# EAGLE design Flight_Controller_Iter2 (EAGLE 9.4.2)

## Sheet 1 of 3
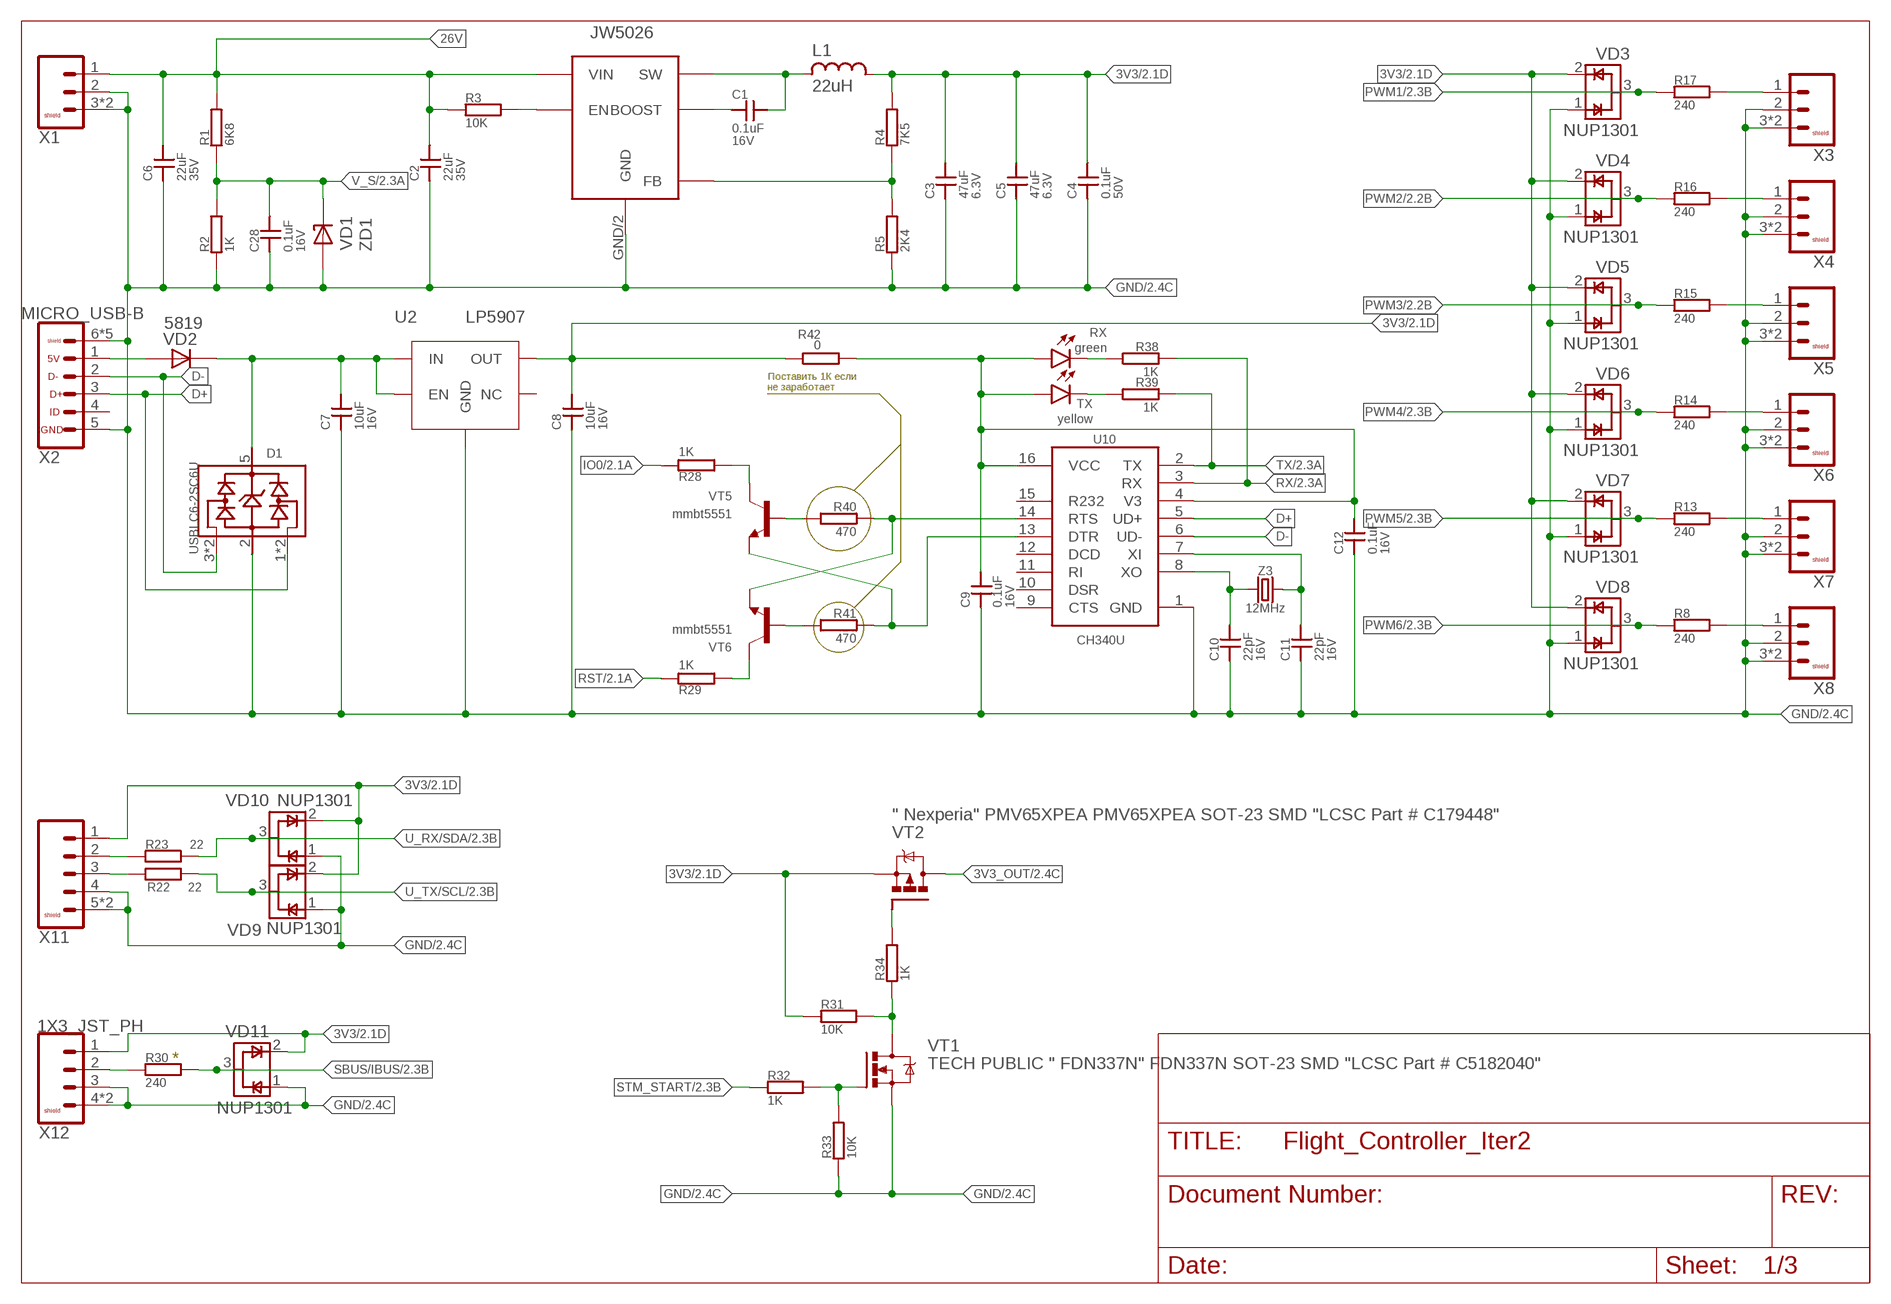
[diagram p0: schematic, sheet 1]

### Parts
C1  0.1uF  C0402  [0402]
C2  22uF  C0805  [0805]
C3  47uF  C0603_SMALL  [0603_SMALL]
C4  0.1uF  C0603_SMALL  [0603_SMALL]
C5  47uF  C0603_SMALL  [0603_SMALL]
C6  22uF  C0805  [0805]
C7  10uF  C0402  [0402]
C8  10uF  C0402  [0402]
C9  0.1uF  C0402  [0402]
C10  22pF  C0402  [0402]
C11  22pF  C0402  [0402]
C12  0.1uF  C0402  [0402]
C28  0.1uF  C0402  [0402]
D1  USBLC6-2SC6U  [SOT23-6]
L1  22uH  INDUCTOR0420CDMC  [0420CDMC]
R1  6K8  R0402  [0402]
R2  1K  R0402  [0402]
R3  10K  R0402  [0402]
R4  7K5  R0402  [0402]
R5  2K4  R0402  [0402]
R8  240  R0402  [0402]
R13  240  R0402  [0402]
R14  240  R0402  [0402]
R15  240  R0402  [0402]
R16  240  R0402  [0402]
R17  240  R0402  [0402]
R22  22  R0402  [0402]
R23  22  R0402  [0402]
R28  1K  R0402  [0402]
R29  1K  R0402  [0402]
R30  240  R0402  [0402]
R31  10K  R0402  [0402]
R32  1K  R0402  [0402]
R33  10K  R0402  [0402]
R34  1K  R0402  [0402]
R38  1K  R0402  [0402]
R39  1K  R0402  [0402]
R40  470  R0402  [0402]
R41  470  R0402  [0402]
R42  0  R0402  [0402]
RX  green  LED1608  [0603]
TX  yellow  LED1608  [0603]
U1  JW5026  TPS560430  [SOT-23-6]
U2  LP5907  [SOT-23-5]
U10  CH340U  [SOIC-16]
VD1  ZD1  ZENER-DIODES  [SOD-323]
VD2  5819  DIODE323  [SOD-323]
VD3  NUP1301  ESD_PROTECTIONSOT123  [SOT23]
VD4  NUP1301  ESD_PROTECTIONSOT123  [SOT23]
VD5  NUP1301  ESD_PROTECTIONSOT123  [SOT23]
VD6  NUP1301  ESD_PROTECTIONSOT123  [SOT23]
VD7  NUP1301  ESD_PROTECTIONSOT123  [SOT23]
VD8  NUP1301  ESD_PROTECTIONSOT123  [SOT23]
VD9  NUP1301  ESD_PROTECTIONSOT123  [SOT23]
VD10  NUP1301  ESD_PROTECTIONSOT123  [SOT23]
VD11  NUP1301  ESD_PROTECTIONSOT123  [SOT23]
VT1  TECH PUBLIC " FDN337N" FDN337N SOT-23 SMD "LCSC Part # C5182040"  N-CANNELSOT-23  [SOT-23]
VT2  " Nexperia" PMV65XPEA PMV65XPEA SOT-23 SMD "LCSC Part # C179448"  P-CANNELSOT-23  [SOT-23]
VT5  mmbt5551  NPNSOT-23  [SOT-23]
VT6  mmbt5551  NPNSOT-23  [SOT-23]
X1  1X2_JST_PH_LF2  [JST-PH-SM2-(LF)]
X2  MICRO_USB-B  [1981584-1]
X3  1X2_JST_PH_LF2  [JST-PH-SM2-(LF)]
X4  1X2_JST_PH_LF2  [JST-PH-SM2-(LF)]
X5  1X2_JST_PH_LF2  [JST-PH-SM2-(LF)]
X6  1X2_JST_PH_LF2  [JST-PH-SM2-(LF)]
X7  1X2_JST_PH_LF2  [JST-PH-SM2-(LF)]
X8  1X2_JST_PH_LF2  [JST-PH-SM2-(LF)]
X11  1X4_JST_PH_2JST_PH_SM4_2MM(LF)  [JST-PH-SM4-(LF)]
X12  1X3_JST_PH  [JST-PH-SM3-(LF)]
Z3  12MHz  CRYSTAL4FOOT  [CRYSTAL-SMD-3.2X2.5MM]

### Nets
3V3: C3.P$2 C4.P$2 C5.P$2 C8.2 L1.2 R4.2 R31.1 R42.2 U2.5(OUT) VD3.2(VCC) VD4.2(VCC) VD5.2(VCC) VD6.2(VCC) VD7.2(VCC) VD8.2(VCC) VD9.2(VCC) VD10.2(VCC) VD11.2(VCC) VT2.2(S) X11.1 X12.1 ; also sheet 2
3V3_OUT: VT2.3(D) ; also sheet 2
26V: C2.P$2 C6.P$2 R1.2 R3.1 U1.IN/5(VIN) X1.1
D+: D1.1(I/O1) D1.6(I/O1) U10.5(UD+) X2.3(D+)
D-: D1.3(I/O2) D1.4(I/O2) U10.6(UD-) X2.2(D-)
DTR: R41.1 U10.13(DTR) VT5.2(E)
GND: C2.P$1 C3.P$1 C4.P$1 C5.P$1 C6.P$1 C7.1 C8.1 C9.1 C10.1 C11.1 C12.1 C28.1 D1.2(GND) R2.1 R5.1 R33.1 U1.GND/2(GND) U2.2(GND) U10.1(GND) VD1.1(A) VD3.1(GND) VD4.1(GND) VD5.1(GND) VD6.1(GND) VD7.1(GND) VD8.1(GND) VD9.1(GND) VD10.1(GND) VD11.1(GND) VT1.2(S) X1.2 X1.3 X1.4 X2.5(GND) X2.6(SHIELD) X2.P$1(SHIELD) X2.P$2(SHIELD) X2.P$3(SHIELD) X2.P$7(SHIELD) X3.2 X3.3 X3.4 X4.2 X4.3 X4.4 X5.2 X5.3 X5.4 X6.2 X6.3 X6.4 X7.2 X7.3 X7.4 X8.2 X8.3 X8.4 X11.4 X11.5 X11.6 X12.3 X12.4 X12.5 ; also sheet 2
IO0: R28.1 ; also sheet 2
N$1: VD2.1(A) X2.1(5V)
N$2: C7.2 D1.5(VBUS) U2.1(IN) U2.3(EN) VD2.2(C)
N$4: R3.2 U1.EN/4(EN)
N$5: C1.1 U1.BOOST/1(BOOST)
N$6: C1.2 L1.1 U1.SW/6(SW)
N$8: R4.1 R5.2 U1.FB/3(FB)
N$11: R17.2 X3.1
N$13: R16.2 X4.1
N$14: R15.2 X5.1
N$15: R14.2 X6.1
N$17: R13.2 X7.1
N$19: R8.2 X8.1
N$21: R38.2 RX.P$1(C)
N$22: R39.2 TX.P$1(C)
N$23: R28.2 VT5.3(C)
N$24: C10.2 U10.8(XO) Z3.3
N$25: C11.2 U10.7(XI) Z3.1
N$26: R40.2 VT5.1(B)
N$27: R41.2 VT6.1(B)
N$32: R29.2 VT6.3(C)
N$35: R23.1 X11.2
N$36: R22.1 X11.3
N$38: R30.1 X12.2
N$45: R31.2 R34.1 VT1.3(D)
N$46: R32.2 R33.2 VT1.1(G)
N$47: R34.2 VT2.1(G)
PWM1: R17.1 VD3.3(I/O) ; also sheet 2
PWM2: R16.1 VD4.3(I/O) ; also sheet 2
PWM3: R15.1 VD5.3(I/O) ; also sheet 2
PWM4: R14.1 VD6.3(I/O) ; also sheet 2
PWM5: R13.1 VD7.3(I/O) ; also sheet 2
PWM6: R8.1 VD8.3(I/O) ; also sheet 2
RST: R29.1 ; also sheet 2
RTS: R40.1 U10.14(RTS) VT6.2(E)
RX: R38.1 U10.3(RX) ; also sheet 2
SBUS/IBUS: R30.2 VD11.3(I/O) ; also sheet 2
STM_START: R32.1 ; also sheet 2
TX: R39.1 U10.2(TX) ; also sheet 2
U_RX/SDA: R23.2 VD10.3(I/O) ; also sheet 2
U_TX/SCL: R22.2 VD9.3(I/O) ; also sheet 2
V_S: C28.2 R1.1 R2.2 VD1.2(C) ; also sheet 2
VCC_1: C9.2 C12.2 R42.1 RX.P$2(A) TX.P$2(A) U10.4(V3) U10.16(VCC)
Unconnected: U2.4(NC) U10.9(CTS) U10.10(DSR) U10.11(RI) U10.12(DCD) U10.15(R232) X2.4(ID)

### Notes on the sheet
- Поставить 1К если
  не заработает
- *

## Sheet 2 of 3
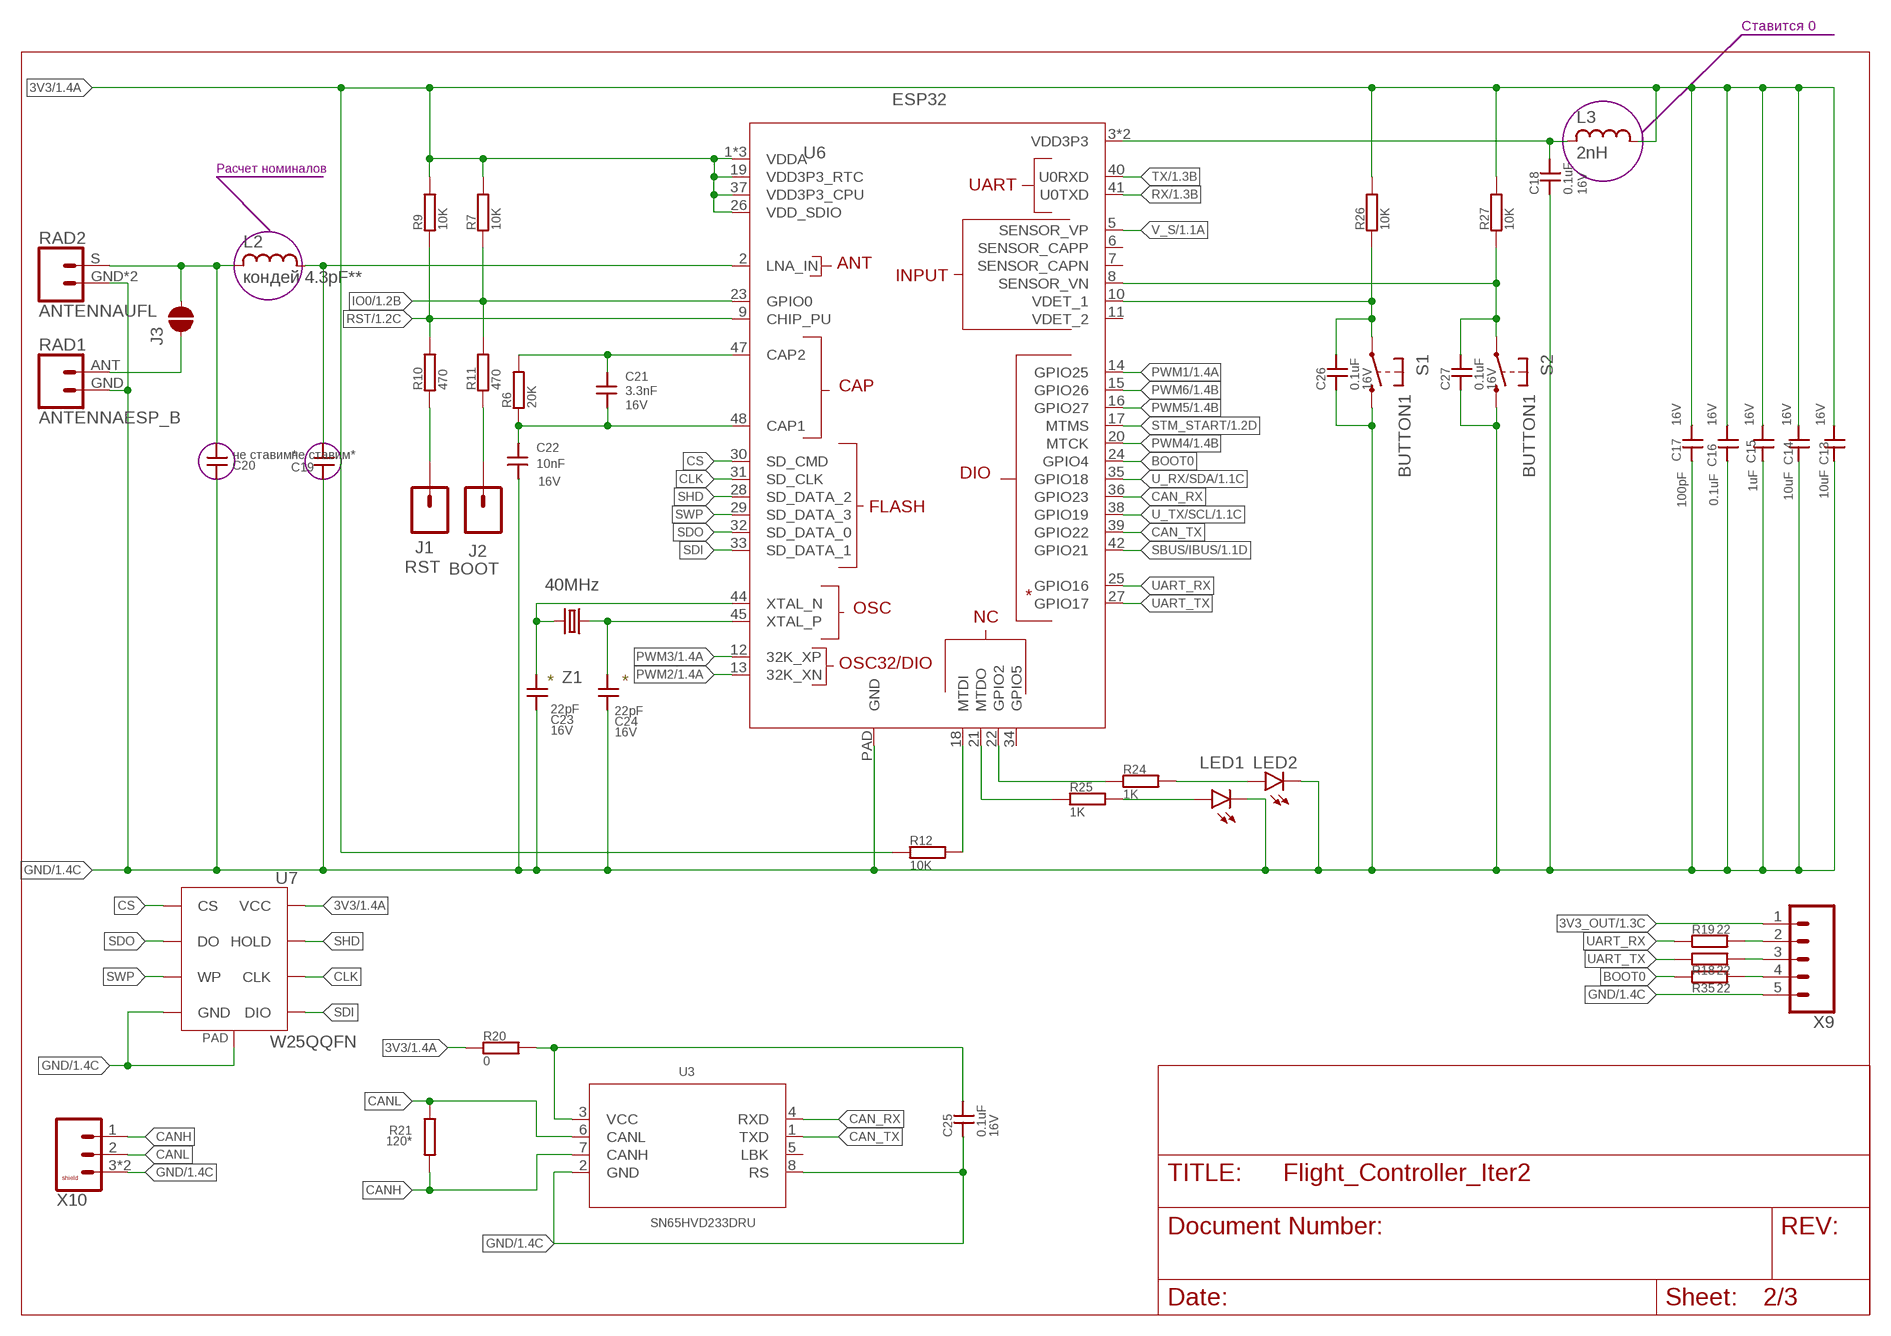
[diagram p1: schematic, sheet 2]

### Parts
C13  10uF  C0402  [0402]
C14  10uF  C0402  [0402]
C15  1uF  C0402  [0402]
C16  0.1uF  C0402  [0402]
C17  100pF  C0402  [0402]
C18  0.1uF  C0402  [0402]
C19  не ставим*  C0402  [0402]
C20  не ставим*  C0402  [0402]
C21  3.3nF  C0402  [0402]
C22  10nF  C0402  [0402]
C23  22pF  C0402  [0402]
C24  22pF  C0402  [0402]
C25  0.1uF  C0402  [0402]
C26  0.1uF  C0402  [0402]
C27  0.1uF  C0402  [0402]
J1  RST  1X1_PAD1X1PAD  [1X1_PAD_T]
J2  BOOT  1X1_PAD1X1PAD  [1X1_PAD_T]
J3  TEST_PAD1X1MM  [TEST_PAD]
L2  кондей 4.3pF**  L0402  [0402]
L3  2nH  L0402  [0402]
LED1  LED0402  [0402]
LED2  LED0402  [0402]
R6  20K  R0402  [0402]
R7  10K  R0402  [0402]
R9  10K  R0402  [0402]
R10  470  R0402  [0402]
R11  470  R0402  [0402]
R12  10K  R0402  [0402]
R18  22  R0402  [0402]
R19  22  R0402  [0402]
R20  0  R0402  [0402]
R21  120*  R0603_SMALL  [0603_SMALL]
R24  1K  R0402  [0402]
R25  1K  R0402  [0402]
R26  10K  R0402  [0402]
R27  10K  R0402  [0402]
R35  22  R0402  [0402]
RAD1  ANTENNAESP_B  [2.4GHZB]
RAD2  ANTENNAUFL  [U.FL]
S1  BUTTON1  [3X4X2]
S2  BUTTON1  [3X4X2]
U3  SN65HVD233DRU  [SOIC-8]
U6  ESP32  [QFN48(5X5MM)]
U7  W25QQFN  [WSON8X6-MM]
X9  1X5FFC5-1MM  [FFC-1MM_5]
X10  1X2_JST_PH_LF2  [JST-PH-SM2-(LF)]
Z1  40MHz  CRYSTAL4FOOT  [CRYSTAL-SMD-3.2X2.5MM]

### Nets
3V3: C13.2 C14.2 C15.2 C16.2 C17.2 L3.2 R7.2 R9.2 R12.1 R20.1 R26.2 R27.2 U6.1(VDDA) U6.19(VDD3P3_RTC) U6.26(VDD_SDIO) U6.37(VDD3P3_CPU) U6.43(VDDA) U6.46(VDDA) U7.P$9(VCC) ; also sheet 1
3V3_OUT: X9.1 ; also sheet 1
BOOT0: R35.1 U6.24(GPIO4)
CAN_RX: U3.4(RXD) U6.36(GPIO23)
CAN_TX: U3.1(TXD) U6.39(GPIO22)
CANH: R21.P$1 U3.7(CANH) X10.1
CANL: R21.P$2 U3.6(CANL) X10.2
CLK: U6.31(SD_CLK) U7.P$7(CLK)
CS: U6.30(SD_CMD) U7.P$2(CS)
GND: C13.1 C14.1 C15.1 C16.1 C17.1 C18.1 C19.1 C20.1 C22.1 C23.1 C24.1 C25.1 C26.1 C27.1 LED1.1(C) LED2.1(C) RAD1.GND RAD2.GND RAD2.GND1(GND) S1.P$2 S2.P$2 U3.2(GND) U3.8(RS) U6.PAD(GND) U7.P$1 U7.P$5(GND) X9.5 X10.3 X10.4 ; also sheet 1
IO0: R7.1 R11.2 U6.23(GPIO0) ; also sheet 1
LED1: R24.1 U6.22(GPIO2)
LED2: R25.1 U6.21(MTDO)
N$3: R18.2 X9.3
N$7: C19.2 L2.2 U6.2(LNA_IN)
N$9: C20.2 J3.P$2 L2.1 RAD2.S(ANTENNA)
N$10: C21.2 R6.2 U6.47(CAP2)
N$12: C21.1 C22.2 R6.1 U6.48(CAP1)
N$16: C23.2 U6.44(XTAL_N) Z1.3
N$18: C24.2 U6.45(XTAL_P) Z1.1
N$20: R12.2 U6.18(MTDI)
N$28: C18.2 L3.1 U6.3(VDD3P3) U6.4(VDD3P3)
N$29: R19.2 X9.2
N$30: LED2.2(A) R24.2
N$31: LED1.2(A) R25.2
N$33: J1.P$1 R10.1
N$34: J2.P$1 R11.1
N$42: J3.P$1 RAD1.ANT(ANTENNA)
N$48: R35.2 X9.4
PWM1: U6.14(GPIO25) ; also sheet 1
PWM2: U6.13(32K_XN) ; also sheet 1
PWM3: U6.12(32K_XP) ; also sheet 1
PWM4: U6.20(MTCK) ; also sheet 1
PWM5: U6.16(GPIO27) ; also sheet 1
PWM6: U6.15(GPIO26) ; also sheet 1
RST: R9.1 R10.2 U6.9(CHIP_PU) ; also sheet 1
RX: U6.41(U0TXD) ; also sheet 1
SBUS/IBUS: U6.42(GPIO21) ; also sheet 1
SDI: U6.33(SD_DATA_1) U7.P$6(DIO)
SDO: U6.32(SD_DATA_0) U7.P$3(DO)
SHD: U6.28(SD_DATA_2) U7.P$8(HOLD)
STM_START: U6.17(MTMS) ; also sheet 1
SW1: C27.2 R27.1 S2.P$1 U6.8(SENSOR_VN)
SW2: C26.2 R26.1 S1.P$1 U6.10(VDET_1)
SWP: U6.29(SD_DATA_3) U7.P$4(WP)
TX: U6.40(U0RXD) ; also sheet 1
U_RX/SDA: U6.35(GPIO18) ; also sheet 1
U_TX/SCL: U6.38(GPIO19) ; also sheet 1
UART_RX: R19.1 U6.25(GPIO16)
UART_TX: R18.1 U6.27(GPIO17)
V_S: U6.5(SENSOR_VP) ; also sheet 1
VCC: C25.2 R20.2 U3.3(VCC)
Unconnected: U3.5(LBK) U6.6(SENSOR_CAPP) U6.7(SENSOR_CAPN) U6.11(VDET_2) U6.34(GPIO5)

### Notes on the sheet
- Ставится 0
- Расчет номиналов
- * | *

## Sheet 3 of 3

## Library data of the parts
C1 C7-C18 C21-C28 = LARS_409_R,C,L:C; VOLTAGE: 16V
C2 C6 = LARS_409_R,C,L:C; VOLTAGE: 35V
C3 C5 = LARS_409_R,C,L:C; VOLTAGE: 6.3V
C4 = LARS_409_R,C,L:C; VOLTAGE: 50V
C19 C20 = LARS_409_R,C,L:C
D1 = LARS_409_MC:USBLC6-2SC6
J1 J2 = LARS_409_CONNECTORS:1X1_PAD
J3 = LARS_409_CONNECTORS:TEST_PAD
L1 = LARS_409_INDUCTOR:INDUCTOR
L2 L3 = LARS_409_R,C,L:L
LED1 LED2 RX TX = LARS_409_LED:LED
R1-R35 R38-R42 = LARS_409_R,C,L:R
RAD1 RAD2 = LARS_409_RADIO:ANTENNA
S1 S2 = LARS_409_SWITCH:BUTTON
U1 = LARS_409_DC-DC:TPS560430
U2 = LARS_409_DC-DC:LP5907
U3 = LARS_409_MC:SN65HVD233DR
U6 = LARS_409_MK:ESP32
U7 = LARS_409_MC:W25Q
U10 = LARS_409_MC:CH340
VD1 = LARS_409_DIODE:ZENER-DIODES
VD2 = LARS_409_DIODE:DIODE
VD3-VD11 = LARS_409_DIODE:ESD_PROTECTION
VT1 = LARS_409_TRANSISTORS:N-CANNEL
VT2 = LARS_409_TRANSISTORS:P-CANNEL
VT5 VT6 = LARS_409_TRANSISTORS:NPN
X1 X3-X8 X10 = LARS_409_CONNECTORS:1X2_JST_PH_LF2
X2 = LARS_409_USB:MICRO_USB-B
X9 = LARS_409_CONNECTORS:1X5
X11 = LARS_409_CONNECTORS:1X4_JST_PH_2
X12 = LARS_409_CONNECTORS:1X3_JST_PH
Z1 Z3 = LARS_409_CLOCKS:CRYSTAL

## Board
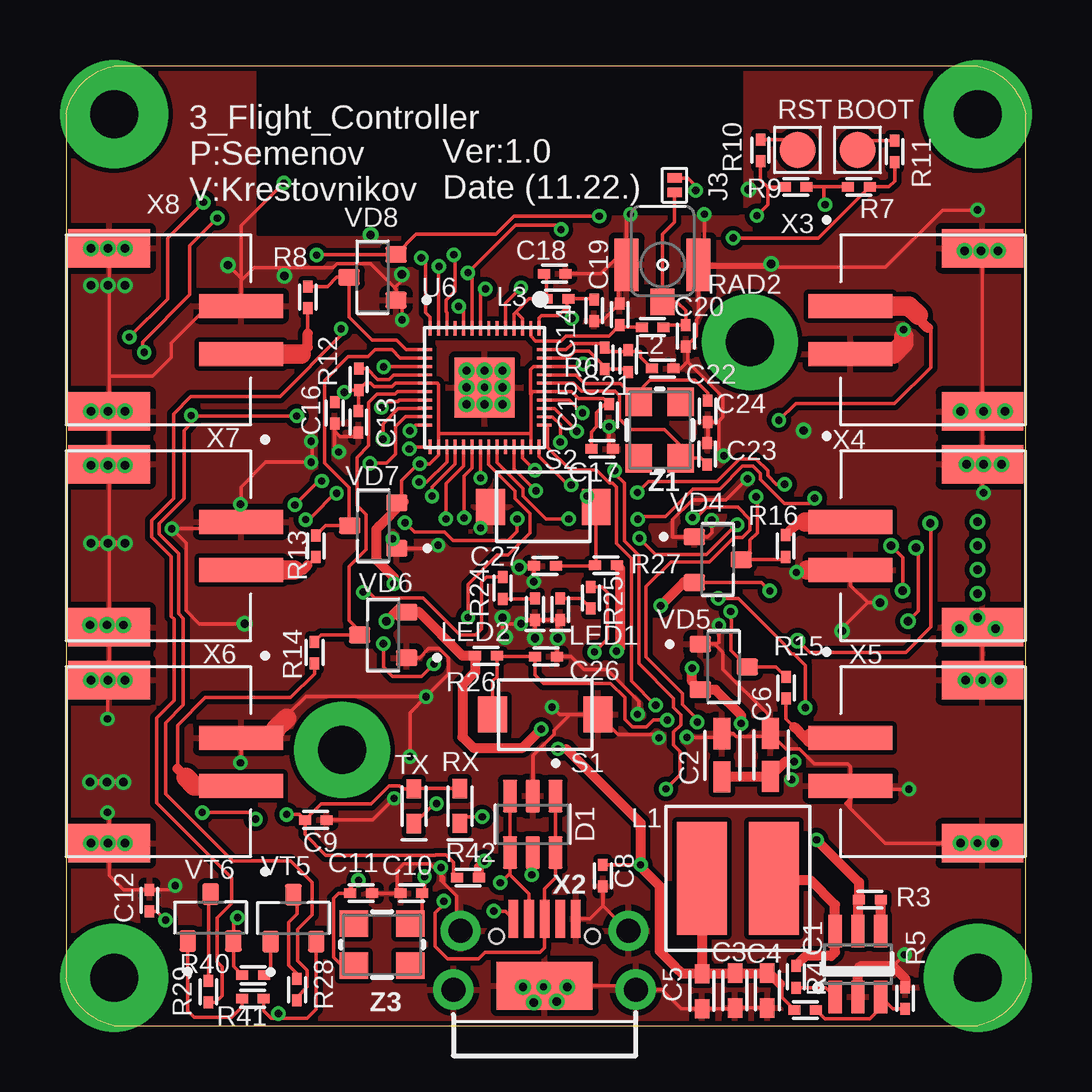
[diagram p2: board, top side]
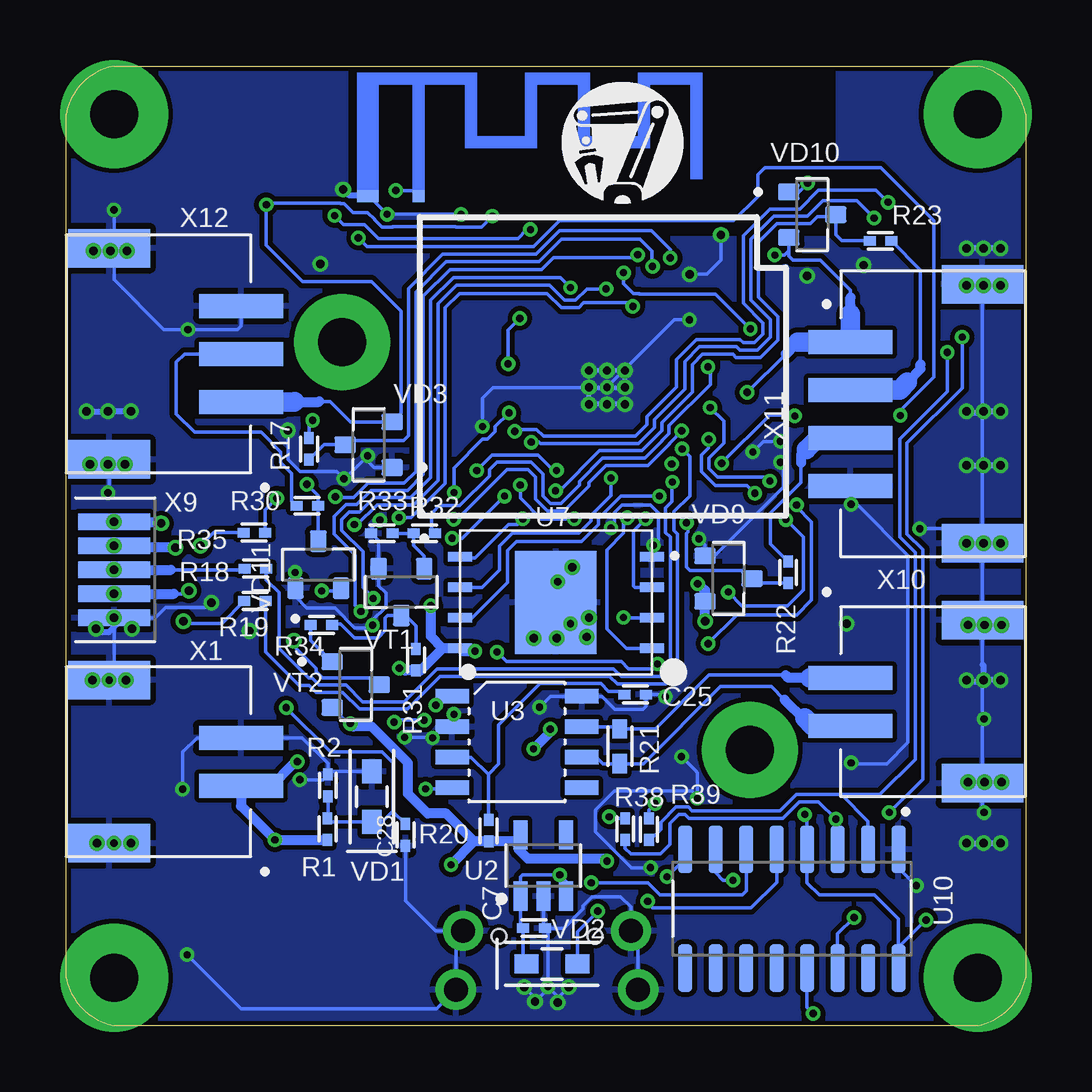
[diagram p3: board, bottom side, seen from below]

Size 40 x 40 mm. Coordinates in mm from the lower left corner, seen from the top.
Outline: 2,0 38,0 arc67 40,2 40,38 arc67 38,40 2,40 arc67 0,38 0,2 arc67 2,0
Copper layers (1*16): Top 0.035mm / dielectric 1.6mm / Bottom 0.035mm
Design rules "pcbWAY": minimum track width 6mil, minimum drill 0.3mm, track to track 6mil, track to pad 6mil, pad to pad 6mil, via to via 6mil, smd to smd 0mil, copper to edge 0.2mm, drill to drill 0.25mm, minimum pad ring 0.15mm, minimum via ring 0.15mm, stop-mask expansion 2mil, vias tented up to drill 3mm, thermal gap 10mil

### Footprints (pad centres in the part's own frame; a part is rotated, then mirrored left to right if it is on the bottom)
0402 = smd 0.5 x 0.4: 1 -0.45,0; 2 0.45,0
0805 = smd 1.3 x 0.7: P$1 -0.9,0; P$2 0.9,0
0603_SMALL = smd 0.8 x 0.6: P$1 -0.727,0; P$2 0.727,0
SOT23-6 = smd 1.36 x 0.6: 1 -1.175,0.95; 2 -1.175,0; 3 -1.175,-0.95; 4 1.175,-0.95; 5 1.175,0; 6 1.175,0.95
1X1_PAD_T = smd 1.5 x 1.5: P$1 0,0
TEST_PAD = smd 0.4 x 0.6: P$1 -0.3,0; P$2 0.3,0
0420CDMC = smd 2.1 x 4.7: 1 -1.5,0; 2 1.5,0
2.4GHZB = smd 0.5 x 0.5 bottom: ANT 4.957,-2.006 | smd 0.9 x 0.5 bottom: GND 7.057,-2.006
U.FL = smd 1 x 2.2: GND -1.5,0; GND1 1.5,0 | smd 1 x 1.1: S 0,-1.55
0603 = smd 0.8 x 0.6: P$1 -0.727,0; P$2 0.727,0
3X4X2 = smd 1.2 x 1.5: P$1 -2.2,0; P$2 2.2,0
SOT-23-6 = smd 0.55 x 1.35: BOOST/1 -0.95,-1.375; EN/4 0.95,1.375; FB/3 0.95,-1.375; GND/2 0,-1.375; IN/5 0,1.375; SW/6 -0.95,1.375
SOT-23-5 = smd 1.217 x 0.589: 1 -1.276,0.95; 2 -1.276,0; 3 -1.276,-0.95; 4 1.276,-0.95; 5 1.276,0.95
SOIC-8 = smd 1.4 x 0.6: 1 -2.7,1.905; 2 -2.7,0.635; 3 -2.7,-0.635; 4 -2.7,-1.905; 5 2.7,-1.905; 6 2.7,-0.635; 7 2.7,0.635; 8 2.7,1.905
QFN48(5X5MM) = smd 0.6 x 0.12: 1 -2.47,2.275; 2 -2.47,1.925; 3 -2.47,1.575; 4 -2.47,1.225; 5 -2.47,0.875; 6 -2.47,0.525; 7 -2.47,0.175; 8 -2.47,-0.175; 9 -2.47,-0.525; 10 -2.47,-0.875; 11 -2.47,-1.225; 12 -2.47,-1.575; 13 -2.47,-1.925; 14 -2.47,-2.275; 25 2.48,-2.275; 26 2.48,-1.925; 27 2.48,-1.575; 28 2.48,-1.225; 29 2.48,-0.875; 30 2.48,-0.525; 31 2.48,-0.175; 32 2.48,0.175; 33 2.48,0.525; 34 2.48,0.875; 35 2.48,1.225; 36 2.48,1.575; 37 2.48,1.925; 38 2.48,2.275 | smd 0.12 x 0.6: 15 -1.575,-2.48; 16 -1.225,-2.48; 17 -0.875,-2.48; 18 -0.525,-2.48; 19 -0.175,-2.48; 20 0.175,-2.48; 21 0.525,-2.48; 22 0.865,-2.48; 23 1.215,-2.48; 24 1.575,-2.48; 39 1.575,2.495; 40 1.225,2.495; 41 0.875,2.495; 42 0.525,2.495; 43 0.175,2.495; 44 -0.175,2.495; 45 -0.525,2.495; 46 -0.875,2.495; 47 -1.225,2.495; 48 -1.575,2.495 | smd 2.5 x 2.5: PAD 0,0
WSON8X6-MM = smd 3.4 x 4.3: P$1 0,0 | smd 1 x 0.4: P$2 -4,1.905; P$3 -4,0.635; P$4 -4,-0.635; P$5 -4,-1.905; P$6 4,-1.905; P$7 4,-0.635; P$8 4,0.635; P$9 4,1.905
SOIC-16 = smd 1.97 x 0.6: 1 -2.475,4.445; 2 -2.475,3.175; 3 -2.475,1.905; 4 -2.475,0.635; 5 -2.475,-0.635; 6 -2.475,-1.905; 7 -2.475,-3.175; 8 -2.475,-4.445; 9 2.475,-4.445; 10 2.475,-3.175; 11 2.475,-1.905; 12 2.475,-0.635; 13 2.475,0.635; 14 2.475,1.905; 15 2.475,3.175; 16 2.475,4.445
SOD-323 = smd 1 x 0.8: 1 -1.062,0; 2 1.042,0
SOT23 = smd 0.7 x 0.9: 1 -0.95,-0.98; 2 0.95,-0.98; 3 0,0.98
SOT-23 = smd 0.7 x 0.9: 1 -0.95,-0.98; 2 0.95,-0.98; 3 0,0.98
JST-PH-SM2-(LF) = smd 1 x 3.5: 1 -1,0.5; 2 1,0.5 | smd 1.6 x 3.4: 3 -3.4,6; 4 3.4,6
1981584-1 = smd 0.4 x 1.6: 1 -1.3,4.4; 2 -0.65,4.4; 3 0,4.4; 4 0.65,4.4; 5 1.3,4.4 | smd 4 x 2: 6 0,1.6 | drill 1 pad 1.676: P$1 -3.8,1.45; P$2 3.5,3.9; P$3 -3.5,3.9; P$7 3.8,1.45 | hole 0.6: -2,3.67; 2,3.67
FFC-1MM_5 = smd 0.7 x 3: 1 -2,0; 2 -1,0; 3 0,0; 4 1,0; 5 2,0
JST-PH-SM4-(LF) = smd 1 x 3.5: 1 -3,0.5; 2 -1,0.5; 3 1,0.5; 4 3,0.5 | smd 1.6 x 3.4: 5 -5.4,6; 6 5.4,6
JST-PH-SM3-(LF) = smd 1 x 3.5: 1 -2,0.5; 2 0,0.5; 3 2,0.5 | smd 1.6 x 3.4: 4 -4.4,6; 5 4.4,6
CRYSTAL-SMD-3.2X2.5MM = smd 1.2 x 1.1: 1 -1.159,-0.843; 2 1.191,-0.843; 3 1.191,0.907; 4 -1.159,0.907

### Placement (x,y rotation side)
C1  30.43,2.03 90 top
C2  27.34,11.27 270 top
C3  27.89,1.46 90 top
C4  29.23,1.46 90 top
C5  26.52,1.43 90 top
C6  29.37,11.28 270 top
C7  20.49,4.06 180 bottom
C8  22.38,6.25 90 top
C9  10.41,8.57 180 top
C10  14.4,5.52 0 top
C11  12.3,5.52 180 top
C12  3.48,5.21 270 top
C13  12.19,25.16 90 top
C14  22.02,29.81 90 top
C15  22.64,25.45 90 top
C16  11.2,25.54 90 top
C17  22.35,24.04 180 top
C18  20.37,31.34 180 top
C19  23.08,29.64 270 top
C20  25.84,28.75 90 top
C21  23.44,27.7 270 top
C22  24.87,27.39 180 top
C23  26.73,23.83 270 top
C24  26.75,25.61 90 top
C25  16.27,13.8 180 bottom
C26  20.01,15.38 180 top
C27  19.97,19.16 0 top
C28  25.85,7.95 90 bottom
D1  19.46,8.39 270 top
J1  30.5,36.5 0 top
J2  33,36.5 0 top
J3  25.37,35.03 270 top
L1  28.01,6.13 180 top
L2  24.45,29.11 180 top
L3  20.49,30.3 0 top
LED1  20.6,17.35 90 top
LED2  19.55,17.35 90 top
R1  29.1,8.19 270 bottom
R2  29.08,10.01 270 bottom
R3  33.51,5.25 0 top
R4  30.82,0.65 180 top
R5  34.98,1.14 270 top
R6  22.45,27.82 270 top
R7  33.05,34.96 180 top
R8  10.08,30.36 270 top
R9  30.42,34.96 0 top
R10  28.95,36.48 270 top
R11  34.54,36.43 270 top
R12  12.2,26.93 90 top
R13  10.42,19.98 270 top
R14  10.36,15.55 270 top
R15  30.02,14.08 270 top
R16  30,19.99 90 top
R17  29.87,24.04 90 bottom
R18  32.1,19.05 180 bottom
R19  32.12,17.7 180 bottom
R20  22.38,8.12 90 bottom
R21  16.91,11.64 270 bottom
R22  9.9,18.89 270 bottom
R23  6.05,32.71 180 bottom
R24  18.2,18.24 270 top
R25  21.88,17.83 270 top
R26  17.51,15.41 180 top
R27  22.51,19.19 0 top
R28  9.63,1.5 90 top
R29  5.94,1.41 90 top
R30  29.94,21.67 0 bottom
R31  25.41,15.25 90 bottom
R32  25.06,20.52 180 bottom
R33  26.83,20.52 0 bottom
R34  29.35,16.7 180 bottom
R35  32.15,20.55 180 bottom
R38  16.69,8.19 90 bottom
R39  15.7,8.18 90 bottom
R40  7.8,2.1 0 top
R41  7.79,1.12 180 top
R42  16.76,6.17 0 top
RAD1  20.35,36.57 0 top
RAD2  24.87,31.71 0 top
RX  16.42,9.15 90 top
S1  19.98,12.96 0 top
S2  19.9,21.62 180 top
TX  14.5,9.14 90 top
U1  33.01,2.57 0 top
U2  20.1,6.67 90 bottom
U3  21.2,11.82 0 bottom
U6  17.45,26.6 270 top
U7  19.58,17.63 180 bottom
U10  9.74,4.87 270 bottom
VD1  27.25,9.53 270 bottom
VD2  19.75,2.57 180 bottom
VD3  27.38,24.21 90 bottom
VD4  27.17,19.42 270 top
VD5  27.42,14.95 270 top
VD6  13.22,16.28 90 top
VD7  12.81,20.84 90 top
VD8  12.78,31.19 90 top
VD9  12.38,18.63 270 bottom
VD10  8.89,33.8 270 bottom
VD11  29.48,19.21 0 bottom
VT1  26.02,18.07 180 bottom
VT2  27.92,14.21 270 bottom
VT5  9.48,4.48 0 top
VT6  6.03,4.5 0 top
X1  32.2,11 90 bottom
X2  19.95,0.05 0 top
X3  32.2,29 270 top
X4  32.2,20 270 top
X5  32.2,11 270 top
X6  7.8,11 90 top
X7  7.8,20 90 top
X8  7.8,29 90 top
X9  38,19 270 bottom
X10  7.8,13.5 270 bottom
X11  7.8,25.5 270 bottom
X12  32.2,28 90 bottom
Z1  24.72,24.84 270 top
Z3  13.16,3.34 0 top

### Tracks (layer width: path | path; a pad name or v marks a point on that pad's centre or on a via)
3V3  (via drill 0.3, 0.35)
  Top 0.152: R4.2 29.85,1.17 29.85,1.65 29.77,1.73 | 27.84,2.19 C3.P$2 | L1.2 C5.P$2 25.69,2.16 | C8.2 23.86,6.7 v23.95,6.7 | 25.53,2.32 25.43,2.42 | VD5.2 26.1,14.34 | R9.2 31.59,34.96 | 31.59,34.96 R7.2 | 20.88,29.94 20.53,29.59 19.82,29.59 19.73,29.49 U6.1 | v21.57,27.58 21.46,27.48 U6.46 19.5,27.48 19.37,27.35 19.37,26.33 19.38,26.32 | 22.61,25.93 22.41,26.13 21.37,26.13 21.08,26.43 U6.43 19.48,26.43 19.38,26.32 | 22.61,25.93 C15.2 | U6.26 15.52,23.79 15.15,23.41 v14.75,23.41 14.68,23.41 13.99,22.72 13.99,21.99 | C14.2 21.98,30.3 L3.2 20.88,30.24 20.88,29.94 | R12.1 11.69,26.48 v11.61,26.39 C16.2 | R12.1 12.5,26.77 12.7,26.77 12.85,26.63 13.59,26.63 13.73,26.77 U6.19 15.48,26.77 15.54,26.72 15.54,24.14 U6.26 | C13.2 R12.1 | 14.08,21.84 13.99,21.93 13.99,21.99 | v10.45,32.12 10.47,32.14 VD8.2 14.6,32.98 17.92,32.98 18.68,33.74 v22.23,33.74 | 14.69,17.26 14.2,17.26 VD6.2 14.09,17.34 | 13.05,20.8 13.05,20.81 | C17.2 21.9,24.75 22.11,24.96 22.11,25.56 22.48,25.93 22.61,25.93 | 23.1,15.75 v22.95,15.6 | 25.76,18.47 VD4.2 28.99,18.47 v29.34,18.12 | U6.37 19.38,24.67 | 19.38,24.67 19.38,26.32 | v21.08,29.48 20.88,29.68 20.88,29.94 | U6.26 15.53,24.66 15.56,24.69 15.58,24.67 19.38,24.67 | v31.65,34.22 31.59,34.28 31.59,34.96 | VD7.2 13.99,21.99 | v28.14,12.59 28.14,12.75 28.15,12.75 | v20.51,11.53 20.86,11.53
  Top 0.406: R42.2 17.21,6.61 v17.45,6.85 | 26.1,14.34 v26.1,14.9 | L1.2 C5.P$2 | 27.84,2.19 26.55,2.19 C5.P$2 25.69,2.16 25.53,2.32 | C3.P$2 C4.P$2 29.31,2.19 29.77,1.73 | 25.43,2.42 24.75,3.1 24.75,5.81 23.86,6.7 | v13.67,18.42 13.67,18.68 12.94,19.41 12.94,20.69 13.05,20.8 | 14.69,17.26 16.54,15.41 R26.2 17.06,14.73 16.53,14.2 16.53,12.03 16.98,11.58 19.04,11.58 v19.81,12.35 | 13.05,20.81 14.08,21.84 | 23.1,15.75 23.1,19.05 R27.2 | v24.79,17.5 25.76,18.47 | 28.15,12.75 28.15,12.93 27.07,14 VD5.2 | v23.95,6.7 23.95,8.44 20.86,11.53 | v13.36,16.85 13.85,17.34 14.09,17.34
  Bottom 0.152: U2.5 21.12,7.87 | 21.12,7.87 21.33,7.67 | 7.3,29.65 7.3,30 | 7.3,30.36 7.3,30.65 8.55,31.9 9.7,31.9 9.87,32.07 9.87,32.3 | 21.12,7.32 21.12,7.87 | 25.93,14.88 26.1,14.71 v26.1,14.9 | 30.47,26.02 29.44,26.02 29,26.02 28.14,25.16 VD3.2 26.03,25.53 26.03,29.78 27.27,31.02 30.13,31.02 31.65,32.54 31.65,34.12 | v13.67,18.42 13.64,18.42 | 25.22,14.8 R31.1 | v10.45,32.12 10.05,32.12 9.87,32.3 | 9.61,28.39 9.5,28.5 | v11.61,26.39 10,28 | 23.45,15.6 U7.P$9 | v21.57,27.58 21.57,28.99 v21.08,29.48 | 31.65,34.12 v31.65,34.22 | 28.01,12.46 v28.14,12.59 28.23,12.59 VT2.2 | v29.34,18.12 28.64,18.12 VD11.2 | v22.23,33.74 22.68,33.29 23.75,33.29 23.76,33.3 26.38,33.3 26.39,33.29 26.83,33.29 27.14,33.6 27.14,33.61 27.42,33.89 28.03,33.89 28.41,34.27 28.56,34.27 28.58,34.29 31.48,34.29 31.65,34.12 | v19.81,12.35 19.81,12.23 | 9.87,32.3 VD10.2
  Bottom 0.406: 21.33,7.67 R20.1 22.98,7.67 | v23.95,6.7 22.98,7.67 | v17.45,6.85 17.55,6.95 20.75,6.95 21.12,7.32 | 25.93,14.88 25.85,14.8 R31.1 | 13.64,18.42 13.36,18.14 VD9.2 v13.36,16.85 | U7.P$9 24.3,15.72 | 25.22,14.8 24.3,15.72 | v22.95,15.6 23.45,15.6 | 24.3,15.72 24.79,16.22 v24.79,17.5 | 22.98,7.67 24.15,8.84 24.92,8.84 25.74,9.66 25.74,10.94 27.26,12.46 28.01,12.46 | 19.81,12.23 v20.51,11.53 | 30.49,26 29.46,26 29.44,26.02 | 7.3,30 7.3,30.36 | 10,28 9.61,28.39
  Bottom 0.813: X12.1 30.49,26 30.47,26.02 | 9.5,28.5 X11.1 7.3,29.65
3V3_OUT  (via drill 0.35)
  Top 0.152: v36.03,20.93 36.06,20.9 36.06,16.61 35,15.55 31,15.55 v30.5,16.05
  Bottom 0.152: 36.19,21 36.1,21 v36.03,20.93 | VT2.3 27.23,14.5 29.31,14.5 29.58,14.77 29.58,14.88 30.5,15.8 v30.5,16.05
  Bottom 0.406: X9.1 36.19,21
  other vias: 38,21
26V  (via drill 0.3)
  Top 0.152: 33.01,5.2 R3.1
  Top 0.406: 33.01,5.2 U1.IN/5 | R3.1 33.06,5.97 v31.29,7.74 | v30.35,11 29.99,11 C6.P$2 C2.P$2
  Bottom 0.152: 32.7,9.93 X1.1
  Bottom 0.406: 32.7,9.93 32.7,9.15 v31.29,7.74 R1.2 | v30.35,11 30.45,10.91 30.52,10.91 31.43,10 X1.1
BOOT0  (via drill 0.3)
  Top 0.152: U6.24 14.57,25.02 v14.33,24.79 | v23.84,21.1 23.96,21.22 24.99,21.22 26.14,22.37 27.25,22.37 28.2,23.32 28.64,23.32 28.95,23.01 28.95,22.77 29.96,21.76 30.99,21.76 v31.21,21.98
  Bottom 0.152: v23.84,21.1 23.69,21.1 21.61,23.18 20.73,23.18 20.42,22.87 20.42,21.95 19.93,21.46 19.25,21.46 18.21,22.5 18.21,22.64 17.5,23.35 15.74,23.35 14.84,24.25 14.84,24.26 14.55,24.54 14.55,24.56 v14.33,24.79 | v31.21,21.98 31.7,21.49 R35.1
CAN_RX  (via drill 0.3)
  Top 0.152: U6.36 19.02,23.66 v19.55,23.14 | v22.88,23.14 22.88,23.02 23.27,22.62 23.27,20.2 23.88,19.59 23.88,15.09 25.32,13.64 25.32,13.25 25.63,12.95 25.63,12.54 25.32,12.23 25.32,11.7 25.6,11.43 25.6,10.45 v25.01,9.86
  Bottom 0.152: v19.55,23.14 19.68,23.14 20.33,23.79 22.25,23.79 23.02,23.02 22.99,23.02 v22.88,23.14 | v25.01,9.86 23.95,9.86 U3.4
CAN_TX  (via drill 0.3)
  Top 0.152: U6.39 20.07,24.9 20.07,24.1 21.02,23.15 22.11,23.15 22.66,22.61 22.79,22.61 22.95,22.44 22.95,20.09 23.57,19.47 23.57,14.36 v24.58,13.35
  Bottom 0.152: v24.58,13.35 24.2,13.72 U3.1
CANH
  Bottom 0.152: U3.7 17,12.46 R21.P$1 15.43,12.37 13.19,14.61 10,14.61
  Bottom 0.406: 9,14.5 9.89,14.5 10,14.61
  Bottom 0.813: X10.1 9,14.5
CANL
  Bottom 0.152: U3.6 17.89,11.19 17.61,10.91 R21.P$2 15.93,10.91 12.71,14.13 10.6,14.13 10.04,13.58
  Bottom 0.203: 9.24,12.77 9.2,12.81
  Bottom 0.406: 10.04,13.58 9.24,12.77 | X10.2 8.88,12.5
  Bottom 0.813: 9.2,12.81 8.88,12.5
CLK  (via drill 0.3)
  Top 0.152: v17.28,22.82 v17.27,22.83 U6.31
  Bottom 0.152: U7.P$7 22.65,18.27 21.92,19 21.92,20 21.39,20.53 18.62,20.53 18.11,21.04 18.11,21.25 17.28,22.09 v17.28,22.82
CS  (via drill 0.3)
  Top 0.152: v16.6,21.16 16.6,22.91 16.93,23.23 U6.30
  Bottom 0.152: U7.P$2 16.64,15.72 17.45,16.54 17.45,19.82 16.75,20.52 16.75,21.01 v16.6,21.16
D+  (via drill 0.3)
  Top 0.152: D1.1 D1.6 20.41,6.16 19.95,5.7 X2.3 19.95,3.25 19.75,3.05 17.46,3.05 17.19,2.78 15.91,2.78 15.38,3.31 15.38,4.69 15.75,5.06 v15.75,5.18
  Bottom 0.152: U10.5 10.38,5.97 11.45,4.9 15.55,4.9 15.75,5.1 v15.75,5.18
D-  (via drill 0.3)
  Top 0.152: D1.3 D1.4 18.51,6.29 | X2.2 19.3,5.5 18.51,6.29 | v18.1,5.95 18.44,6.29 18.51,6.29
  Bottom 0.152: U10.6 11.64,5.61 11.8,5.45 15.25,5.45 15.75,5.95 v18.1,5.95
DTR  (via drill 0.3)
  Top 0.152: VT5.2 10.43,0.68 10.05,0.3 9,0.3 | R41.1 8.24,0.61 8.55,0.3 9,0.3 | 9,0.3 8.85,0.45 v8.85,0.5
  Bottom 0.152: v8.85,0.5 9.11,0.76 U10.13
GND  (via drill 0.3, 0.35)
  Top 0.152: v26.92,21.07 26.92,20.55 26.74,20.37 VD4.1 25.29,20.37 25.29,21.09 26.11,21.91 27.51,21.91 28.39,22.79 v28.42,22.79 | v24.72,11.99 24.57,12.14 23,12.14 S1.P$2 21,12.96 | 21,12.96 20.57,12.96 v20.26,13.27 | X5.3 X4.4 | 34.92,28.72 v34.92,29.01 | C4.P$1 C3.P$1 27.86,0.7 C5.P$1 25.65,0.7 24.85,1.5 X2.P$7 23.6,1.65 X2.6 | v4.55,5.83 4.38,5.66 C12.1 2.4,5.66 1.8,6.26 X6.3 1.8,8.81 v1.73,8.88 | C11.1 C10.1 13.8,5.67 13.8,6.46 14.07,6.73 15.18,6.73 15.73,6.18 15.73,5.95 | v1.73,12.78 1.73,14.33 X6.4 X7.3 | 1.8,16.7 1.8,20.05 1.8,20.15 X7.4 X8.3 1.8,27.07 | X8.4 1.8,27.07 | C18.1 22.3,31.34 23.03,32.07 23.03,31.87 | C14.1 22.35,29.36 C19.1 23.03,30.14 23.03,31.87 | 23.03,31.87 23.19,31.71 RAD2.GND 23.37,33.66 v23.53,33.82 | X8.2 5.93,30 4.38,28.45 4.38,27.84 3.61,27.07 1.8,27.07 | X8.2 7.3,31.15 | 7.3,31.15 7.3,33.34 v9.08,35.12 | C13.1 12.04,24.56 11.43,24.56 11.2,24.79 C16.1 11.2,24.08 v11.37,23.91 | X7.2 7.3,21.7 v7.27,21.73 | v10.22,24.35 10.26,24.31 10.26,23.53 v10.21,23.48 v10.22,23.48 8.33,23.48 7.3,22.45 X7.2 | v15.51,20.02 15.38,19.89 VD7.1 13.79,20.12 v13.61,20.29 | D1.2 19.46,11.25 20.34,12.13 20.34,12.3 21,12.96 | LED1.1 20.46,16.76 C26.1 21.06,15.38 21.6,14.84 22.56,14.84 23.89,13.51 23.89,13.04 v23.83,12.97 | LED1.1 LED2.1 | C17.1 22.64,24.2 v22.64,24.97 C15.1 | v38.25,22.21 38.2,22.26 X4.3 X3.4 X12.5 38.2,32.35 v38.15,32.3 | v14.01,29.42 14.01,29.99 VD8.1 13.76,30.7 13.71,30.75 | 9.29,13.01 10.01,13.73 15.03,13.73 v15.01,13.71 | VD6.1 14.74,15.33 15.12,15.71 15.56,15.71 15.95,15.32 15.95,14.65 v15.01,13.71 | v26.61,33.82 26.61,31.95 RAD2.GND1 | C22.1 25.61,27.39 25.93,27.7
  Top 0.152: 25.93,27.7 25.93,28.21 C20.1 26.27,28.73 26.27,29.42 26.37,29.52 RAD2.GND1 | C8.1 22.38,5 | 22.38,5 22.38,4.99 21.84,4.45 X2.5 | 22.38,5 23.43,3.95 X2.P$2 | 29.25,12.06 27.92,12.06 27.82,12.17 C2.P$1 27.18,12.01 v25.88,12.01 | 29.25,12.06 C6.P$1 30.02,11.53 30.57,11.53 31.2,10.9 32.6,10.9 32.7,10.8 X5.2 32.7,9.06 | 30.71,19 30.91,19 | v27.22,16.69 27.22,15.98 27.14,15.9 VD5.1 27.04,15.9 27.39,15.55 27.39,14.85 29.25,12.99 29.25,12.06 | X5.4 v38,7.6 34.16,7.6 32.7,9.06 | 32.7,9.06 32.51,9.26 33.1,9.85 v35.14,9.85 | S2.P$2 17.28,21.2 v17.28,20.74 | 15.73,5.95 16.28,5.4 16.28,4.12 X2.P$3 | X6.2 7.3,10.98 v7.27,10.95 | 34.45,2.48 34.48,2.48 v34.95,2.95 | C9.1 12.78,8.57 v13.68,9.47 | v14.34,11.21 14.34,13.04 v15.01,13.71 | 15.73,5.95 15.63,6.04 v15.63,6.58 | C23.1 26.75,24.3 C24.1 27.19,25.16 27.23,25.2 | 27.23,25.2 27.39,25.36 27.39,26.19 27.18,26.4 27.18,26.41 25.93,27.66 25.93,27.7 | v27.42,23.75 27.23,23.95 27.23,25.2 | X7.2 7.01,20.71 v4.41,20.71 5,20.12 5,17.3 5.55,16.75 v7.45,16.75 | v19.5,18.5 19.52,18.52 C27.1 18.96,19.16 v18.9,19.1 | LED2.1 19.12,16.9 v18.97,16.75 18.45,16.75 v18.2,17 18.2,16.3 v18.3,16.2 | RAD2.GND1 26.47,31.61 34.16,31.61 36.55,34 v38,34 | 13.71,30.75 12.69,31.77 11.31,31.77 11.13,31.59 8.9,31.59 | X8.2 7.3,31.05 7.84,31.59 8.9,31.59 | v33.93,17.63 33.42,17.63 | 33.42,17.63 32.7,18.35 X4.2 | RAD2.GND1 29.36,31.71 v29.4,31.75 | X2.6 20.45,1.15 v20.45,1 | X2.6 v19.91,1.61 | X2.6 v19.9,1.6 v19.05,1.6 | v14,31.31 14,31.05 13.71,30.75 | 33.42,17.63 32.35,16.56 v32.35,16.45 | v9.1,31.25 8.9,31.45 8.9,31.59 | v20.5,16.15 20.5,16.8 LED1.1 | v6.75,31.7 7.3,31.15 | v19.55,16.15 LED2.1
  Top 0.254: 9.19,12.81 9.19,12.91 9.29,13.01 | X7.4 v1.75,23.35 v1.05,23.35 | X7.3 v1.7,16.7 | X7.3 1.8,16.7 | X7.3 1.9,16.7 v2.4,16.7 | X7.3 1.1,16.6 v1,16.7 | X3.4 v39.15,25.6 | v2.45,20.1 1.85,20.1 1.8,20.15 | v1.05,20.1 v1.75,20.1 1.8,20.05 | X8.4 v2.45,32.4 | v1,10.15 v1.7,10.15 v2.4,10.15 | X6.3 v1.75,7.6
  Top 0.406: R5.1 34.98,1.95 34.45,2.48 33.14,2.48 33.01,2.35 U1.GND/2 | v30.45,18.89 30.56,19 30.71,19
  Top 0.813: X3.2 34.48,28 34.92,28.44 34.92,28.72 | 30.91,19 X4.2 | X6.2 8.43,12 8.74,12.31 8.74,12.36 9.19,12.81
  Bottom 0.152: v30.25,10.25 29.29,10.25 R2.1 29.08,10.5 | 29.08,10.5 29.08,10.93 30.15,12 X1.2 34.54,12 35.14,11.4 v35.14,9.85 | VD1.1 28.99,10.59 29.08,10.5 | v26.92,21.07 27.28,20.71 R33.1 26.97,20.21 VT1.2 26.97,18.33 26.66,18.03 26.66,17.46 27.25,16.86 | v20.26,13.27 19.8,13.72 U3.8 17.65,13.72 17.11,13.18 15.94,13.18 15.82,13.3 C25.1 15.1,13.8 v15.01,13.71 | X12.5 38,32.6 | 38,32.6 v38,34 | X12.3 32.7,29.15 32.84,29.01 v34.92,29.01 35.92,29.01 38,31.09 38,32.6 | v4.55,5.83 5.29,6.58 U10.1 | v1.73,8.88 1.8,8.95 X10.4 1.8,12.71 v1.73,12.78 1.8,12.85 1.8,14.35 1.8,15.05 X10.3 1.8,20.03 | X2.P$1 16.15,3.65 X2.P$3 16.45,4.94 16.88,5.37 18.08,5.37 18.45,5 18.45,4.86 19.25,4.06 C7.1 | 1.8,20.03 X11.6 1.8,23.35 1.8,25.55 X8.3 X11.5 | v9.08,35.12 9.45,34.75 VD10.1 | X11.4 7.27,22.47 v7.27,21.73 7.04,21.73 4.9,19.59 4.9,11.8 5.79,10.91 7.23,10.91 v7.27,10.95 | v10.22,24.35 10.93,24.35 v11.37,23.91 | v10.22,23.48 10.1,23.36 10.1,22.44 12.96,19.58 VD9.1 13.36,20.04 v13.61,20.29 | U7.P$5 15.58,19.95 v15.51,20.02 15.31,20.22 15.31,21.37 15.63,21.69 16.82,21.69 17.13,21.38 17.13,20.89 v17.28,20.74 | v38.25,22.21 38.2,22.26 X12.4 | 17.4,26.65 14.63,29.42 v14.01,29.42 | v23.53,33.82 v26.61,33.82 27.36,34.57 RAD1.GND | C7.1 20.1,4.12 U2.2 | v19.91,1.61 19.91,3.93 C7.1 | v25.88,12.01 24.74,12.01 v24.72,11.99 24.25,12.46 U3.2 23.9,12.9 v23.83,12.97 | v30.45,18.89 30.43,18.87 VD11.1 30.43,17.88 29.96,17.41 28.79,17.41 27.96,16.58 27.54,16.58 27.25,16.86 | v27.22,16.69 27.22,16.83 27.25,16.86 | v34.95,2.95 32.7,0.7 24.55,0.7 X2.P$7 23.75,3.65 X2.P$2 24.6,3.95 25.85,5.2 C28.1 | v13.68,9.47 13.68,9.55
  Bottom 0.152: 13.68,9.55 13.68,10.53 13.73,10.58 13.73,10.6 v14.34,11.21 | v15.63,6.58 16.43,6.58 17.92,8.07 17.92,9 17.14,9.78 13.91,9.78 13.68,9.55 | VD3.1 27.15,23.26 27.42,23.53 v27.42,23.75 28.38,22.79 v28.42,22.79 28.72,23.09 30.24,23.09 30.75,23.6 v30.75,24.8 | v4.41,20.71 2.48,20.71 1.8,20.03 | v19.5,18.5 19.5,17.71 | 19.5,17.71 U7.P$1 | v18.97,16.75 18.97,17.18 19.5,17.71 | v22.64,24.97 22.64,26.16 22.2,26.6 v18.2,26.6 | X9.5 38,14.6 38.12,14.47 | 37.95,17 37.6,17 36.28,17 35.85,17.43 34.13,17.43 v33.93,17.63 | v19.05,1.6 19.5,1.15 v19.5,0.95 19.5,1.2 v19.91,1.61 | v19.91,1.61 19.91,1.54 v20.45,1 20.45,1.15 v20.9,1.6 | v12.7,32.95 12.7,31.9 13.29,31.31 v14,31.31
  Bottom 0.203: v16.7,25.9 v17.45,25.9 v18.2,25.9 v18.2,26.6 U6.PAD | U6.PAD 17.4,26.65 | U6.PAD v16.7,26.6 v16.7,27.3 v17.45,27.3 v18.2,27.3
  Bottom 0.254: v37.25,16.55 37.7,17 37.95,17 X9.5 | v38.75,16.55 38.6,16.4 38.2,16.4 37.6,17 | X5.3 38.12,14.47 | X5.3 v37.5,14.4 | X5.3 v38.9,14.4 | v37.3,25.6 v38.25,25.6 v39.15,25.6 | X12.4 38,23.4 v37.55,23.4 | X12.5 38.1,32.3 v37.45,32.3 | X12.5 38.15,32.35 v38.15,32.3 | X12.5 38.75,32.4 v38.85,32.3 | v1.05,25.6 v1.75,25.6 X8.3 | v2.45,25.6 2.4,25.55 1.8,25.55 | v2.45,30.85 1.85,30.85 X11.5 v1.75,30.85 v1.05,30.85 | v1.05,32.4 v1.75,32.4 v2.45,32.4 | v1.05,23.35 v1.75,23.35 | v2.45,23.35 1.8,23.35 | X5.4 v38,7.6 | X5.4 v38.7,7.6 | X5.4 v37.3,7.6 | v1.05,7.6 v1.75,7.6 v2.45,7.6 | X12.4 38.25,23.55 v38.25,23.4 | X12.4 38.4,23.4 v39,23.4 | v1.05,14.4 v1.75,14.4 1.75,15 1.8,15.05 | v2.45,14.4 2.4,14.35 1.8,14.35 | X10.4 1.85,10.15 v2.4,10.15 | RAD1.GND 27.46,34.62 28.21,34.62 v28.45,34.85
  other vias: 17.45,26.6 38.2,14.4 38,17
  pour Top (isolate 0.2, rank 2): 0,41 41,41 41,-1 -1,-1 -1,41
  pour Bottom (isolate 0.2, rank 2): -2,42 42,42 42,35 42,-2 -2,-2
GNDCUT
  cutout Bottom: 15,40 15,33 8,33 8,40
GNDCUT1
  cutout Top: 8,40 8,33 15,33 15,40
IO0  (via drill 0.3)
  Top 0.152: R11.2 34.55,35.2 34.31,34.96 R7.1 31.37,32.83 v27.81,32.83 | R28.1 9.63,1.18 10.06,1.6 10.06,2.29 9.65,2.7 9.65,4 10.26,4.61 10.26,5.97 9.37,6.86 6.94,6.86 4.15,9.65 4.15,12.62 4.89,13.36 4.89,16.98 4.7,17.17 4.7,19.68 3.88,20.49 3.88,20.93 4.92,21.97 4.92,24.81 5.22,25.11 | v12.67,23.44 13.36,23.44 13.74,23.82 13.74,24.96 14.16,25.38 U6.23 | 5.22,25.11 5.52,25.41 v9.62,25.41 | 5.22,25.11 v5.22,25.43
  Bottom 0.152: v9.62,25.41 9.66,25.45 10.66,25.45 v12.67,23.44 | v5.22,25.43 5.22,25.63 3.83,27.02 3.83,33.56 6.04,35.77 10.86,35.77 11.16,35.47 11.16,34.56 12.17,33.55 19.43,33.55 20.5,32.48 27.45,32.48 v27.81,32.83
LED1  (via drill 0.3)
  Top 0.152: U6.22 14.96,25.73 14.67,25.73 14.65,25.71 13.85,25.71 13.21,25.07 v13.21,24.44 | R24.1 17.53,18.69 17.33,18.49 17.33,16.53 17.08,16.28 16.43,16.28 14.89,17.82 12.86,17.82 12.61,18.07 v12.39,18.07 | v9.99,21.09 10.12,21.22 10.25,21.22 11.22,22.19 v11.28,22.19
  Bottom 0.152: v12.39,18.07 11.82,17.5 9.92,17.5 9.27,18.15 9.27,20.37 v9.99,21.09 | v11.28,22.19 11.61,22.52 12.93,22.52 13.5,23.09 13.5,23.79 13.21,24.08 v13.21,24.44
LED2  (via drill 0.3)
  Top 0.152: U6.21 13.9,26.07 13.84,26.02 13.41,26.02 v13.15,25.76 | R25.1 22.35,18.28 22.57,18.06 22.57,16.11 v22.03,15.57 | v15.34,15.07 14.83,14.56 13.62,14.56 13.23,14.95 v13.23,15.92 | v9.54,21.7 10.54,22.7 v10.66,22.7
  Bottom 0.152: v22.03,15.57 21.63,15.17 16.84,15.17 16.54,14.87 15.54,14.87 v15.34,15.07 | v13.23,15.92 12.03,17.12 9.54,17.12 8.92,17.74 8.92,21 9.54,21.62 v9.54,21.7 | v10.66,22.7 10.83,22.87 12.84,22.87 12.88,22.91 12.89,22.91 13.2,23.22 13.2,23.66 12.58,24.28 12.58,25.19 v13.15,25.76
N$1  (via drill 0.3)
  Top 0.152: v17.83,4.77 18.33,4.77 X2.1
  Bottom 0.152: VD2.1 18.69,3.91 v17.83,4.77
N$2  (via drill 0.3)
  Top 0.152: v19.42,6.28 19.42,7.17 D1.5
  Bottom 0.152: VD2.2 20.94,2.72 C7.2 21.05,4.17 U2.1 21.05,6.2 20.97,6.28 v19.42,6.28 19.15,6.01 U2.3
N$3  (via drill 0.35)
  Bottom 0.152: 35.62,19 32.6,19 R18.2
  Bottom 0.406: X9.3 35.62,19
  other vias: 38,19
N$4
  Top 0.406: U1.EN/4 R3.2
N$5
  Top 0.152: U1.BOOST/1 31.68,1.58 C1.1
N$6
  Top 0.152: 29.63,6.13 L1.1 | 31.9,2.9 32,3 | 32.06,3.66 U1.SW/6
  Top 0.406: U1.SW/6 32.06,5.04 31.05,6.05 29.71,6.05 29.63,6.13 | C1.2 30.85,2.9 31.9,2.9 | 32,3 32.06,3.06 32.06,3.66
N$7
  Top 0.152: L2.2 23.16,29.11 C19.2 22.64,28.75 20.84,28.75 20.63,28.54 19.57,28.54 19.38,28.73 U6.2
N$8
  Top 0.152: R4.1 31.64,0.28 33.5,0.28 33.96,0.74 U1.FB/3 34.47,0.69 R5.2
N$9
  Top 0.152: L2.1 24.99,29.2 C20.2 25.84,29.8 25.48,30.16 RAD2.S 24.87,32.99 25.37,33.49 J3.P$2
N$10
  Top 0.152: U6.47 20.93,27.82 21.23,28.11 21.81,28.11 22.45,27.47 R6.2 23.32,27.37 C21.2
N$11  (via drill 0.3)
  Top 0.152: v29.72,25.23 30.42,25.93 34.54,25.93 36.05,27.43 36.05,28.96 35.93,29.08
  Top 0.203: 35.15,30 35.47,29.68 35.47,29.55
  Top 0.406: 35.47,29.55 35.93,29.08
  Top 0.813: 35.53,29.61 35.15,30 X3.1
  Bottom 0.152: v29.72,25.23 29.87,25.08 R17.2
N$12
  Top 0.152: U6.48 20.84,28.18 21.11,28.43 22.29,28.43 R6.1 22.63,28.09 23.13,28.09 | 23.13,28.09 23.38,28.09 C21.1 | C22.2 23.95,27.86 23.95,28.1 23.14,28.1 23.13,28.09
N$13
  Top 0.152: 30.14,20.59 R16.2
  Top 0.406: 30.82,21 30.56,21 30.14,20.59
  Top 0.813: X4.1 30.82,21
N$14
  Top 0.152: R15.2 30.02,12.78 30.36,12.45 | 31.08,12 31,12
  Top 0.406: 31,12 30.8,12 30.36,12.45
  Top 0.813: X5.1 31.08,12
N$15
  Top 0.152: R14.2 10.36,14.66 9.37,13.67 5.81,13.67 4.65,12.51 4.65,10.7 5,10.35
  Top 0.406: 5.35,10 4.65,10.7
  Top 0.813: X6.1 5.35,10 5,10.35
N$16
  Top 0.152: C23.2 26.46,23.65 Z1.3 25.63,24.16 24.95,24.84 23.51,24.84 23.17,25.18 23.17,25.19 23.08,25.28 23.08,26.26 22.89,26.45 21.49,26.45 21.16,26.77 U6.44
N$17
  Top 0.152: 10.07,19.18 R13.2
  Top 0.406: 9.5,19 9.89,19 10.07,19.18
  Top 0.813: X7.1 9.5,19
N$18
  Top 0.152: C24.2 26.75,26.37 26.22,26.9 24.35,26.9 23.73,26.28 23.73,26.15 Z1.1 23.12,26.75 21.61,26.75 21.25,27.11 U6.45
N$19
  Top 0.152: 10.08,28.85 R8.2
  Top 0.406: 9.8,28 10.08,28.28 10.08,28.85
  Top 0.813: X8.1 9.8,28
N$20
  Top 0.152: R12.2 12.55,27.38 13,26.93 13.46,26.93 13.65,27.12 U6.18
N$21  (via drill 0.3)
  Top 0.152: RX.P$1 16.7,8.7 v17.35,8.7
  Bottom 0.152: v17.35,8.7 17.29,8.64 R38.2
N$22  (via drill 0.3)
  Top 0.152: TX.P$1 15.34,9.25 v15.45,9.25
  Bottom 0.152: v15.45,9.25 15.7,9 R39.2
N$23
  Top 0.152: VT5.3 9.63,5.31 9.63,4.66 9.27,4.3 9.27,2.5 9.63,2.15 R28.2
N$24  (via drill 0.3)
  Top 0.152: v14.95,6.2 14.95,5.62 C10.2 14.85,4.75 Z3.3
  Bottom 0.152: U10.8 14.19,6.96 v14.95,6.2
N$25  (via drill 0.3)
  Top 0.152: Z3.1 11.5,2.5 11.15,2.85 11.15,5.3 11.37,5.52 C11.2 11.85,5.71 v12.2,6.05
  Bottom 0.152: U10.7 12.91,6.37 12.61,6.05 v12.2,6.05
N$26
  Top 0.152: R40.2 8.53,2.38 VT5.1
N$27
  Top 0.152: VT6.1 5.08,3 5.08,0.62 5.35,0.35 6.9,0.35 7.34,0.79 R41.2
N$28
  Top 0.152: C18.2 20.04,31.22 L3.1 19.31,30.3 18.75,29.74 | 18.75,29.74 18.68,29.66 U6.4 | U6.3 19.02,29.46 18.75,29.74
N$29  (via drill 0.35)
  Top 0.152: v35.44,19.91 35.54,19.81 35.54,17.29 v35.1,16.85
  Bottom 0.152: R19.2 33.5,16.77 35.02,16.77 v35.1,16.85 | 35.47,19.94 v35.44,19.91
  Bottom 0.406: X9.2 37.94,19.94 35.47,19.94
  other vias: 38,20
N$30
  Top 0.152: LED2.2 R24.2
N$31
  Top 0.152: LED1.2 21.46,17.8 R25.2
N$32
  Top 0.152: R29.2 5.94,5.39 VT6.3
N$33
  Top 0.152: J1.P$1 30.07,36.93 R10.1
N$34
  Top 0.152: J2.P$1 33.38,36.88 R11.1
N$35
  Bottom 0.152: R23.1 4.38,31.49 4.38,27.57 | 4.93,26.82 4.88,26.88
  Bottom 0.406: 4.88,26.88 4.38,27.37 4.38,27.57
  Bottom 0.813: X11.2 5.25,26.5 4.93,26.82
N$36
  Bottom 0.152: R22.1 10.63,20.07 10.63,21.36 9.36,22.63 9.36,23.45
  Bottom 0.406: 9.14,24.02 9.36,23.8 9.36,23.45
  Bottom 0.813: X11.3 8.66,24.5 9.14,24.02
N$37  (via drill 2 pad 4.5)
  other vias: 38,38
N$38
  Bottom 0.152: R30.1 30.59,21.87 30.59,23.01 31.05,23.47 31.05,23.91 31.87,24.73 34.63,24.73 35.4,25.5 35.4,27.66 35.06,28 X12.2
N$39  (via drill 2 pad 4.5)
  other vias: 38,2
N$40  (via drill 2 pad 4.5)
  other vias: 2,2
N$41  (via drill 2 pad 4.5)
  other vias: 2,38
N$42  (via drill 0.3)
  Top 0.152: J3.P$1 25.92,35.33 26.25,35 v26.25,34.81
  Bottom 0.152: v26.25,34.81 25.55,34.81 RAD1.ANT
N$43  (via drill 2 pad 4)
  other vias: 28.5,28.5
N$44  (via drill 2 pad 4)
  other vias: 11.5,11.5
N$45
  Bottom 0.152: R31.2 25.4,16.65 25.84,17.09 VT1.3 26.6,17.09 26.69,17 26.69,16.47 27,16.16 27.97,16.16 28.54,16.73 28.87,16.73 R34.1
N$46
  Bottom 0.152: VT1.1 25.07,19.57 25.51,20.01 R32.2 R33.2
N$47
  Bottom 0.152: VT2.1 29.8,16.06 R34.2
N$48  (via drill 0.35)
  Top 0.152: v34.88,18.13 34.88,19.52 v34.4,20
  Bottom 0.152: R35.2 33.85,20.55 v34.4,20 | 35.51,18 35.01,18 v34.88,18.13
  Bottom 0.406: X9.4 35.51,18
  other vias: 38,18
PWM1  (via drill 0.3)
  Top 0.152: v14.81,32 14.99,31.82 14.99,29.71 15.18,29.53 U6.14
  Bottom 0.152: R17.1 29.25,24.21 VD3.3 28.19,24.38 25.93,24.38 25.72,24.6 25.72,30.73 24.3,32.15 20.4,32.15 19.42,33.13 15.6,33.13 14.81,32.34 v14.81,32
PWM2  (via drill 0.3)
  Top 0.152: U6.13 15.53,31.62 v15.55,31.64 | R16.1 29.88,19.42 VD4.3 28.51,19.78 28.51,20.23 28.82,20.54 28.82,21.98 v28.77,22.03 v28.77,22.04
  Bottom 0.152: v15.55,31.64 15.58,31.68 15.58,32.29 16.07,32.78 19.34,32.78 20.28,31.84 24.15,31.84 25.41,30.58 25.41,23.1 25.9,22.61 27.41,22.61 28.01,22.02 28.75,22.02 v28.77,22.04
PWM3  (via drill 0.3)
  Top 0.152: R15.1 29.6,14.95 VD5.3 27.71,15.64 27.71,16.43 27.75,16.47 27.75,16.91 27.71,16.94 v27.71,17.26 | v16.17,32.13 16.22,32.08 16.22,30.62 15.84,30.25 15.84,29.76 15.88,29.73 U6.12
  Bottom 0.152: v16.17,32.13 16.28,32.02 19.67,32.02 20.18,31.51 24,31.51 25.1,30.41 25.1,22.98 25.77,22.31 27.29,22.31 27.89,21.71 28.33,21.71 28.82,21.23 28.82,20.48 27.95,19.62 27.95,17.5 v27.71,17.26
PWM4
  Top 0.152: R14.1 10.64,16.28 VD6.3 12.24,16.44 11.8,16.89 11.8,19.14 12.51,19.85 12.51,21.3 12.13,21.68 12.13,23.68 12.62,24.17 12.62,25.98 12.96,26.32 13.71,26.32 13.81,26.43 U6.20
PWM5
  Top 0.152: R13.1 10.83,20.84 11.81,20.84 | 11.81,20.84 VD7.3 | U6.16 13.93,27.82 13.59,28.17 12.89,28.17 12.6,27.88 11.76,27.88 10.77,26.89 10.77,23.46 11.81,22.42 11.81,20.84
PWM6
  Top 0.152: R8.1 10.9,30.8 11.29,31.19 VD8.3 11.8,29.54 12.77,28.57 13.78,28.57 14.17,28.18 U6.15
RST  (via drill 0.3)
  Top 0.152: R10.2 28.95,35.25 29.25,34.95 | 29.25,34.95 R9.1 | R29.1 6.21,0.96 6.5,1.25 6.5,2.45 6.3,2.65 6.3,4.5 6.9,5.1 6.9,6.16 3.78,9.28 3.78,12.83 4.5,13.55 4.5,16.94 4.39,17.05 4.39,19.55 3.58,20.36 3.58,21.05 4.48,21.96 4.48,25.5 5.2,26.22 8.92,26.22 11.47,28.77 v11.47,29.04 | U6.9 16.93,31.21 v16.76,31.38 18.74,33.37 20.45,33.37 v20.64,33.18 | v28.8,33.76 29.25,34.21 29.25,34.95
  Bottom 0.152: v11.47,29.04 12.92,30.49 16.09,30.49 16.1,30.51 16.35,30.51 16.76,30.92 v16.76,31.38 | v28.8,33.76 28.43,33.39 27.56,33.39 26.98,32.81 21.16,32.81 20.79,33.18 v20.64,33.18
RTS  (via drill 0.3)
  Top 0.152: R40.1 6.98,2.47 VT6.2 6.98,4.33 v7.15,4.5
  Bottom 0.152: U10.14 7.83,3.81 v7.15,4.5
RX  (via drill 0.3)
  Top 0.152: v21.29,24.77 21.29,24.79 20.36,25.73 U6.41 | v5.73,34.32 4.23,32.82 4.23,30.29 v2.64,28.7 | v5.68,8.88 7.63,8.88 v7.91,8.61
  Bottom 0.152: U10.3 7.83,8.54 v7.91,8.61 8.63,9.33 9.42,9.33 10.11,8.64 14.03,8.64 14.19,8.8 14.45,8.8 14.82,8.43 14.82,7.56 15.23,7.15 16.45,7.15 16.69,7.39 R38.1 | v21.29,24.77 21.21,24.85 20.38,24.85 20.1,24.57 16.26,24.57 15.77,25.06 15.77,25.39 14.55,26.61 14.55,27.76 13.71,28.6 11.91,28.6 11.77,28.46 11.3,28.46 10.94,28.82 10.94,29.29 11.76,30.11 11.76,32.93 10.65,34.04 9.41,34.04 8.63,34.82 6.23,34.82 v5.73,34.32 | v2.64,28.7 2.64,26.57 4.94,24.27 4.94,20.49 4.29,19.84 4.29,10.27 v5.68,8.88
SBUS/IBUS  (via drill 0.3)
  Top 0.152: U6.42 21,26.07 v21.53,25.54 | v29.96,22.56 29.62,22.56 29.25,22.93 29.25,23.14 28.77,23.62 28.07,23.62 27.13,22.68 24.27,22.68 v23.82,22.22
  Bottom 0.152: VD11.3 R30.2 29.49,22.09 v29.96,22.56 | v23.82,22.22 23.82,23.25 22.63,24.44 22.42,24.44 22.11,24.75 22.11,24.96 v21.53,25.54
SDI  (via drill 0.3)
  Top 0.152: v20.96,21.12 20.01,21.12 19.06,22.07 19.06,22.39 17.98,23.47 U6.33
  Bottom 0.152: U7.P$6 23.53,19.48 22.96,19.48 21.55,20.89 21.18,20.89 v20.96,21.12
SDO  (via drill 0.3)
  Top 0.152: U6.32 17.61,23.38 18.72,22.27 18.72,21.97 19.34,21.35 19.34,20.52 18.42,19.61 17.97,19.61 16.75,18.38 v16.75,17.02 v16.76,17.01
  Bottom 0.152: v16.76,17.01 16.75,17 U7.P$3
SHD  (via drill 0.3)
  Top 0.152: v15.26,22.07 15.26,22.45 16.23,23.41 U6.28
  Bottom 0.152: U7.P$8 23.07,17 21.59,18.47 21.59,19.79 21.21,20.17 18.52,20.17 17.81,20.88 17.81,21.13 16.87,22.07 v15.26,22.07
STM_START  (via drill 0.3)
  Top 0.152: U6.17 13.26,27.48 v13.24,27.46
  Bottom 0.152: R32.1 24.77,20.68 24.77,21.33 24.68,21.42 24.68,21.43 24.44,21.67 23.59,21.67 22.35,22.92 22.35,23.17 22.03,23.49 20.61,23.49 20.12,23 20.12,22.07 19.81,21.76 19.37,21.76 18.6,22.53 18.6,22.68 17.62,23.66 15.86,23.66 15.15,24.37 15.15,24.38 14.86,24.67 14.86,25.01 13.14,26.73 13.14,27.36 v13.24,27.46
SW1  (via drill 0.3)
  Top 0.152: C27.2 22.03,19.16 R27.1 22.1,19.23 S2.P$1 22.1,21.69 v21.72,22.07 | U6.8 17.27,30.5 v17.48,30.71 | v23.91,20.31 24.58,19.64 26.7,19.64 27.71,20.66 27.76,20.66 v27.98,20.88
  Bottom 0.152: v27.98,20.88 27.86,20.88 27.04,21.7 25.52,21.7 24.5,22.72 24.5,30.09 23.72,30.86 19.85,30.86 19.22,30.23 18.75,30.23 18.28,30.71 v17.48,30.71 | v23.91,20.31 23.48,20.31 v21.72,22.07
SW2  (via drill 0.3)
  Top 0.152: S1.P$1 17.78,14.36 17.96,14.54 R26.1 17.99,15.38 C26.2 19.56,14.61 19.9,14.27 22.7,14.27 23.3,13.67 23.3,12.75 23.61,12.44 24.2,12.44 24.48,12.73 v25.07,12.73 | U6.10 16.57,29.77 v16.37,29.98 | v26.12,21.17 26.27,21.17 26.7,21.6 26.87,21.6 26.88,21.61 28,21.61 28.51,21.1 28.51,20.66 28.2,20.35 27.84,20.35 26.82,19.33 25.21,19.33 24.18,18.3 24.18,15.36 25.7,13.84 25.7,13.38 26.32,12.76 v26.32,12.65
  Bottom 0.152: v16.37,29.98 16.52,30.13 18.42,30.13 18.62,29.93 19.35,29.93 19.94,30.52 23.6,30.52 24.19,29.93 24.19,22.6 25.61,21.17 v26.12,21.17 | v26.32,12.65 26.24,12.73 v25.07,12.73
SWP  (via drill 0.3)
  Top 0.152: v15.84,21.12 15.84,22.6 16.57,23.33 U6.29
  Bottom 0.152: U7.P$4 16.29,18.27 16.34,18.32 16.34,20.62 v15.84,21.12
TX  (via drill 0.3)
  Top 0.152: v20.6,24.32 v20.61,24.33 20.61,25.04 20.28,25.38 U6.40 | v6.31,33.66 5.16,32.51 5.16,30.46 3.2,28.5 3.2,28.12 v3.26,28.06
  Bottom 0.152: U10.2 6.57,8.52 7.68,9.63 | 7.68,9.63 9.54,9.63 10.24,8.94 13.9,8.94 14.06,9.11 14.58,9.11 15.21,8.48 15.21,8.18 15.65,7.73 R39.1 | v20.6,24.32 20.28,24.32 20.23,24.27 16.13,24.27 15.47,24.93 15.47,25.26 14.2,26.53 14.2,27.68 13.59,28.29 12.05,28.29 11.92,28.16 11.18,28.16 10.64,28.7 10.64,29.42 11.45,30.23 11.45,32.78 10.5,33.73 9.09,33.73 8.44,34.38 7.03,34.38 v6.31,33.66 | v3.26,28.06 3.26,26.43 5.24,24.45 5.24,20.36 4.59,19.72 4.59,11.1 6.07,9.63 7.68,9.63
U_RX/SDA  (via drill 0.3)
  Top 0.152: U6.35 18.68,23.2 v19.59,22.29
  Bottom 0.152: R23.2 7.66,32.71 7.91,32.96 7.91,33.71 | VD10.3 7.91,33.71 | v19.59,22.29 19.42,22.29 17.75,23.96 16,23.96 15.16,24.8 15.16,25.13 13.89,26.4 13.89,27.55 13.46,27.99 12.2,27.99 12.06,27.85 11.05,27.85 10.33,28.57 10.33,29.54 11.14,30.36 11.14,32.65 10.36,33.43 8.96,33.43 8.68,33.71 7.91,33.71
U_TX/SCL  (via drill 0.3)
  Top 0.152: v14.13,20.96 14.52,20.57 15.78,20.57 16.14,20.21 18.43,20.21 18.81,20.59 v18.81,21.12 | U6.38 19.73,23.73 20.92,22.53 v21.06,22.53
  Bottom 0.152: R22.2 11.21,18.44 VD9.3 11.74,18.97 13.99,18.97 14.07,19.05 14.14,19.12 14.14,20.51 14.07,20.58 14.07,20.9 v14.13,20.96 | v18.81,21.12 20.19,21.12 21.06,21.99 v21.06,22.53
UART_RX  (via drill 0.3)
  Top 0.152: U6.25 14.4,24.12 v14.31,24.04
  Bottom 0.152: v14.31,24.04 14,23.72 14,22.08 14.66,21.42 14.66,20.64 14.51,20.49 14.51,14.73 14.99,14.24 15.26,14.24 15.27,14.23 17.01,14.23 17.34,14.56 24.41,14.56 25.52,13.45 25.52,13.43 25.75,13.2 27.76,13.2 28.46,13.89 29.57,13.89 29.86,14.19 30.29,14.19 31.67,15.57 R19.1
UART_TX  (via drill 0.3)
  Top 0.152: U6.27 15.88,23.5 15.04,22.66 v14.72,22.66
  Bottom 0.152: v14.72,22.66 14.73,22.65 14.73,21.85 15,21.58 15,20.55 14.81,20.36 14.81,14.85 15.12,14.54 16.85,14.54 17.17,14.86 24.54,14.86 25.82,13.57 25.82,13.56 25.88,13.5 27.64,13.5 28.33,14.2 29.44,14.2 29.73,14.49 29.89,14.49 31.12,15.72 31.12,18.05 31.65,18.58 R18.1
V_S  (via drill 0.3)
  Top 0.152: U6.5 18.32,30.11 v18.97,30.76 | v27.19,17.81 28.03,17.81 29.95,15.89 29.95,15.82 30.27,15.5 30.34,15.5 30.83,15.01 v30.83,13.25 v30.82,13.25
  Bottom 0.152: R2.2 29.08,8.66 R1.1 28.95,8.49 VD1.2 26.83,8.49 26.39,8.94 | v18.97,30.76 19.39,31.18 23.85,31.18 24.8,30.23 24.8,22.85 25.64,22.01 27.16,22.01 27.76,21.41 28.2,21.41 28.51,21.1 28.51,20.64 27.62,19.75 27.62,18.25 27.19,17.82 v27.19,17.81 | 26.39,8.94 26.36,8.96 26.36,10.94 26.82,11.4 28.97,11.4 v30.82,13.25 | C28.2 26.39,8.94
VCC
  Bottom 0.152: R20.2 22.38,10.46 22.39,10.47 | U3.3 23.11,11.19 22.39,10.47 | 22.39,10.47 21.96,10.9 21.96,12.54 20.25,14.25 17.7,14.25 17.38,13.93 16.84,13.93 C25.2
VCC_1  (via drill 0.3)
  Top 0.152: v4.15,4.4 3.79,4.76 C12.2 | v9.2,8.8 9.73,8.8 C9.2 | C9.2 10.64,9.25 12.71,9.25 13.46,10 13.9,10 14.03,9.87 TX.P$2 RX.P$2 | R42.1 16.23,6.17 16.16,6.24 16.16,6.8 15.85,7.11 15.41,7.11 15.39,7.09 10.83,7.09 9.96,7.96 C9.2
  Bottom 0.152: U10.16 5.29,3.25 | 5.29,3.25 v4.15,4.4 | 5.29,3.25 5.29,4.45 6.3,5.45 8.6,5.45 9.11,5.96 U10.4 9.11,8.71 v9.2,8.8

### Text on the board
tPlace: RST | BOOT | 3_Flight_Controller / P:Semenov / V:Krestovnikov | Ver:1.0 / Date (11.22.)